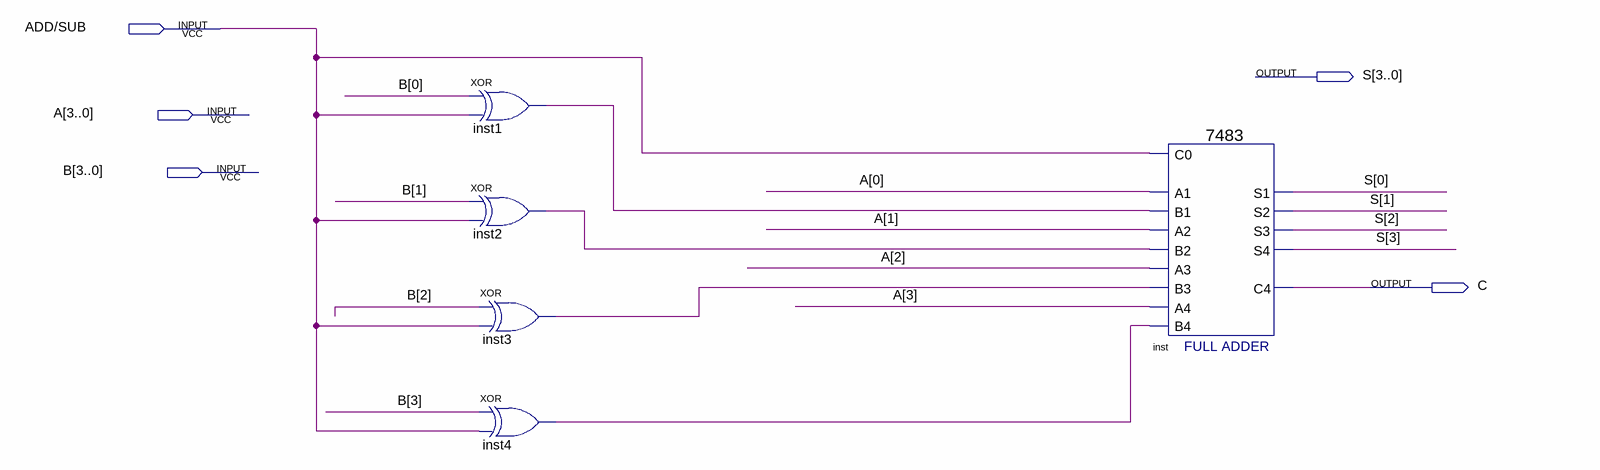
[diagram p0: schematic sheet]
// Quartus schematic addsub.bdf as structural Verilog: 5 symbols, 5 pins
module addsub (
  input  \ADD/SUB ,
  input  [3:0] A,
  input  [3:0] B,
  output [3:0] S,
  output C
);

  wire inst1_out, inst2_out, inst3_out, inst4_out;

  xor inst1 (inst1_out, B[0], \ADD/SUB );
  xor inst2 (inst2_out, B[1], \ADD/SUB );
  xor inst3 (inst3_out, B[2], \ADD/SUB );
  xor inst4 (inst4_out, B[3], \ADD/SUB );
  \7483  inst (
    .B4(inst4_out), .C0(\ADD/SUB ), .A1(A[0]), .A2(A[1]), .B1(inst1_out), .B2(inst2_out), .A3(A[2]),
    .B3(inst3_out), .A4(A[3]), .S3(S[2]), .S4(S[3]), .S2(S[1]), .C4(C), .S1(S[0]));
endmodule
